# Altium schematic sheet -5v_Regulator.SchDoc: -5V Battery Regulator
size A4; Organization: Altium Limited; Address1: L3, 12a Rodborough Rd; Address2: Frenchs Forest; Address3: NSW; Address4: Australia 2086
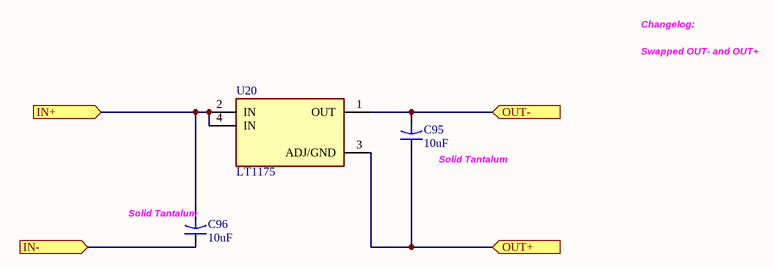
[diagram p0: -5v_Regulator.SchDoc]

## Parts
C95  10uF  [Tantalum_2917]
C96  10uF  [Tantalum_2917]
U20  LT1175  [REG_LT1117IST-5#PBF]

## Ports
IN+ (in), IN- (in), OUT+ (in), OUT- (in)

## Nets
IN+: C96.2 U20.2(IN) U20.4(IN) ; port IN+
IN-: C96.1 ; port IN-
OUT+: C95.1 U20.3(ADJ/GND) ; port OUT+
OUT-: C95.2 U20.1(OUT) ; port OUT-

## Notes on the sheet
- Changelog:
- Swapped OUT- and OUT+
- (near C95) Solid Tantalum
- (near C96) Solid Tantalum
- Title
- Date:
- RE:
- Arturo di Girolamo
- Size:
- A3
- A

## Library data of the parts
C95 C96 = UVR1V102MHD1TO: Capacitor, 100uF NICHICON; ASYPN: T495D106K035ATE260; MFGPN: UVR1V102MHD1TO
U20 = LT1175: ASYPN: LT1175IST-5#TRPBF